# EAGLE design LPS22HB_pcb_v2 (EAGLE 8.2.2)
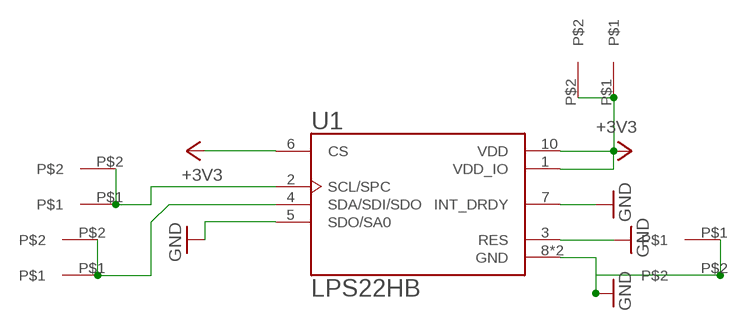
[diagram p0: schematic, sheet 1]

## Parts
U1  LPS22HB  [LGA10R50P2X3_200X200X80]
U$1  WIREPAD_PADWIREPAD_0,6/0,4_PAD  [WIREPAD_0,6/0,4_PAD]
U$2  WIREPAD_PADWIREPAD_0,6/0,4_PAD  [WIREPAD_0,6/0,4_PAD]
U$6  WIREPAD_PADWIREPAD_0,6/0,4_PAD  [WIREPAD_0,6/0,4_PAD]
U$7  WIREPAD_PADWIREPAD_0,6/0,4_PAD  [WIREPAD_0,6/0,4_PAD]

## Nets
+3V3: U1.1(VDD_IO) U1.6(CS) U1.10(VDD) U$1.P$1 U$1.P$2
GND: U1.3(RES) U1.5(SDO/SA0) U1.7(INT_DRDY) U1.8(GND) U1.9(GND) U$2.P$1 U$2.P$2
N$2: U1.2(SCL/SPC) U$6.P$1 U$6.P$2
N$3: U1.4(SDA/SDI/SDO) U$7.P$1 U$7.P$2

## Library data of the parts
U1 = LPS22HB:LPS22HB: MEMS nano pressure sensor: 260-1260 hPa absolute digital output barometer; AVAILABILITY: Unavailable; DESCRIPTION: MEMS nano pressure sensor: 260-1260 hPa absolute digital output barometer; MF: STMicroelectronics; MP: LPS22HB; PACKAGE: None; PRICE: None
U$1 U$2 U$6 U$7 = Sombeck_lib:WIREPAD_PAD

## Board
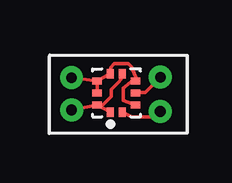
[diagram p1: board, top side]
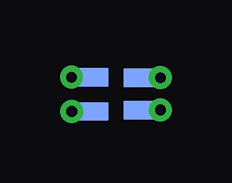
[diagram p2: board, bottom side, seen from below]

No outline drawn. Coordinates in mm, seen from the top.
Copper layers (1*16): Top 0.035mm / dielectric 1.5mm / Bottom 0.035mm
Design rules "default": minimum track width 6mil, minimum drill 0.35mm, track to track 6mil, track to pad 6mil, pad to pad 6mil, via to via 6mil, smd to smd 6mil, copper to edge 40mil, drill to drill 6mil, minimum pad ring 10mil, minimum via ring 8mil, stop-mask expansion 4mil, vias tented up to drill 0mil, thermal gap 10mil

### Footprints (pad centres in the part's own frame; a part is rotated, then mirrored left to right if it is on the bottom)
LGA10R50P2X3_200X200X80 = smd 0.4 x 0.3: 1 -0.8,0.25; 2 -0.8,-0.25; 6 0.8,-0.25; 7 0.8,0.25 | smd 0.3 x 0.4: 3 -0.5,-0.8; 4 0,-0.8; 5 0.5,-0.8; 8 0.5,0.8; 9 0,0.8; 10 -0.5,0.8
WIREPAD_0,6/0,4_PAD = drill 0.45 pad 0.813: P$1 0,0.051 | smd 0.762 x 1.27: P$2 0,-0.838

### Placement (x,y rotation side)
U1  2.76,1.67 90 top
U$1  0.94,0.95 270 bottom
U$2  0.94,2.3 270 bottom
U$6  4.54,0.9 90 bottom
U$7  4.55,2.32 90 bottom

### Tracks (layer width: path | path; a pad name or v marks a point on that pad's centre or on a via)
+3V3
  Top 0.152: U1.1 U1.10 | U$1.P$1 U1.10 | U1.10 2.11,1.09 2.54,1.51 2.54,1.81 2.86,2.12 3.01,2.32 U1.6
  Bottom 0.152: U$1.P$1 U$1.P$2
GND
  Top 0.152: U1.9 U1.8 | U1.8 1.2,2.27 U$2.P$1 | U1.8 U1.7 2.51,2.57 2.52,2.73 2.66,2.9 3.25,2.9 3.39,2.76 3.57,2.34 U1.5 3.39,2.14 3.27,2.07 3.11,1.92 3.05,1.87 3.06,1.36 U1.3
  Bottom 0.152: U$2.P$1 U$2.P$2
N$2
  Top 0.152: U1.2 3.4,0.67 4.37,0.67 U$6.P$1
  Bottom 0.152: U$6.P$1 U$6.P$2
N$3
  Top 0.152: U1.4 3.58,1.69 3.96,1.69 U$7.P$1
  Bottom 0.152: U$7.P$1 U$7.P$2